# Altium schematic sheet rf_bms.SchDoc: mcHF Pro Transceiver RF board
size A3; Author: Krassi Atanassov; CompanyName: MØNKA; Engineer: For radio amateurs experimentation, non-commercial use only. Thank you!; Revision: 0.8.5; SheetTotal: 14
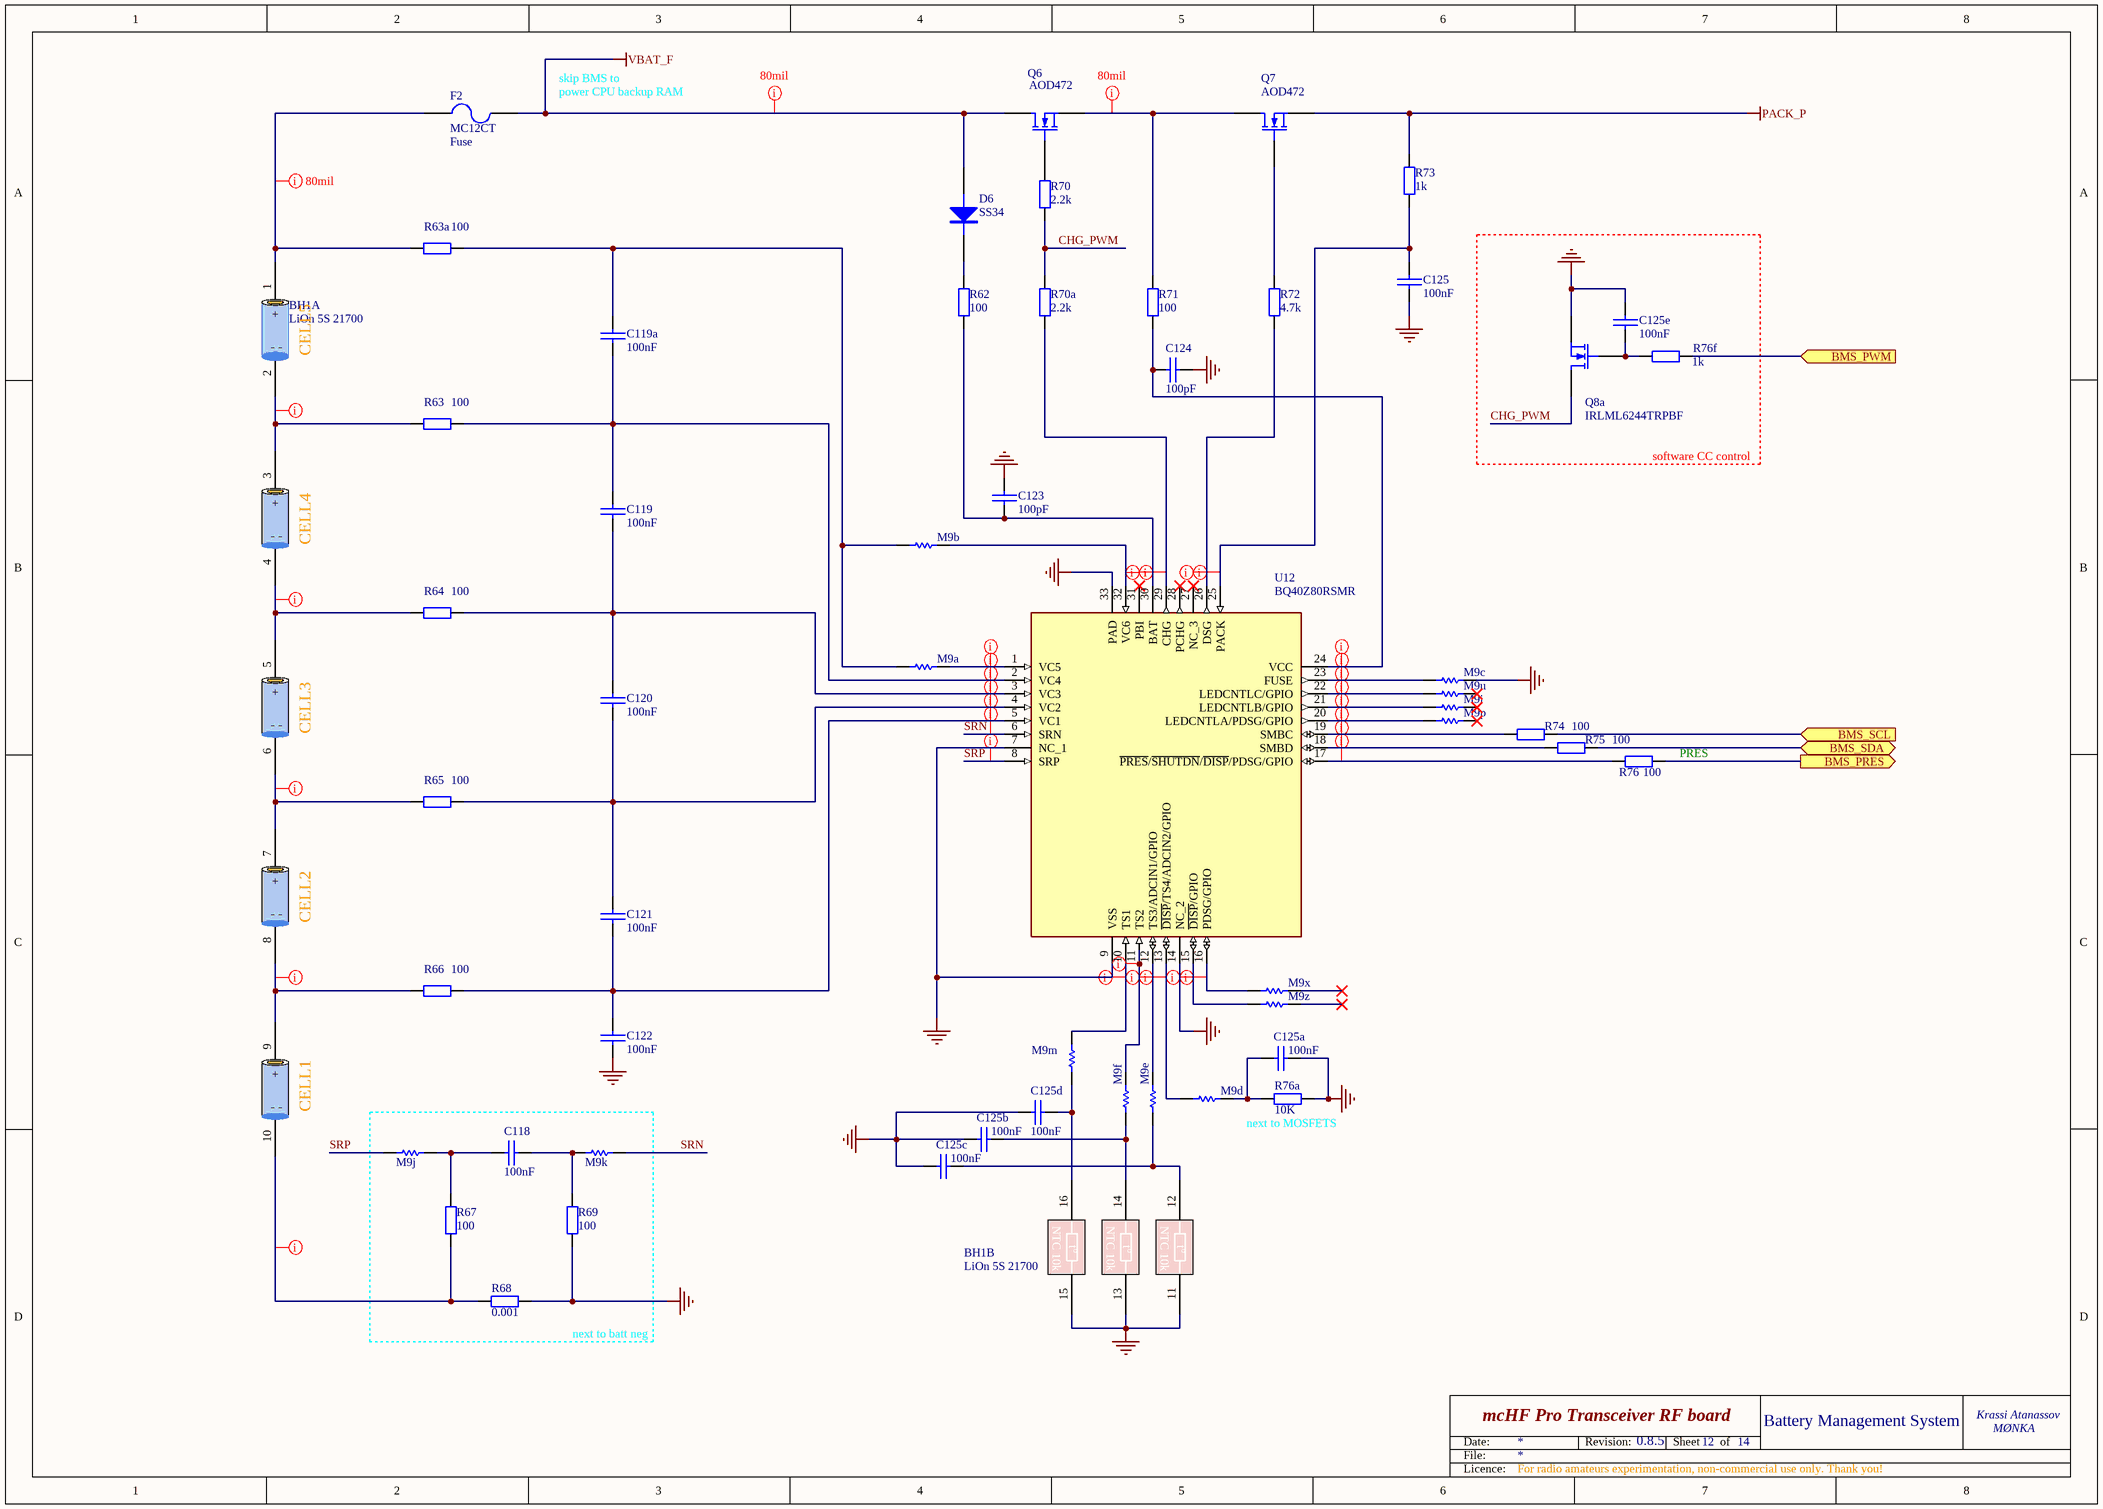
[diagram p0: rf_bms.SchDoc]

## Parts
BH1  LiOn 5S 21700  [BATT_HOLDER_5S]  (parts A,B of 2)
C118  100nF  [0805]
C119  100nF  [0805]
C119a  100nF  [0805]
C120  100nF  [0805]
C121  100nF  [0805]
C122  100nF  [0805]
C123  100pF  [0805]
C124  100pF  [0805]
C125  100nF  [0805]
C125a  100nF  [0805]
C125b  100nF  [0805]
C125c  100nF  [0805]
C125d  100nF  [0805]
C125e  100nF  [0805]
D6  SS34  [DO214]
F2  MC12CT  [1206]
M9a  0  [SB_0603_10]  (value not drawn)  (net tie, no BOM)
M9b  0  [SB_0603_10]  (value not drawn)  (net tie, no BOM)
M9c  0  [SB_0603_10]  (value not drawn)  (net tie, no BOM)
M9d  0  [SB_0603_10]  (value not drawn)  (net tie, no BOM)
M9e  0  [SB_0603_10]  (value not drawn)  (net tie, no BOM)
M9f  0  [SB_0603_10]  (value not drawn)  (net tie, no BOM)
M9i  0  [SB_0603_10]  (value not drawn)  (net tie, no BOM)
M9j  0  [SB_0603_10]  (value not drawn)  (net tie, no BOM)
M9k  0  [SB_0603_10]  (value not drawn)  (net tie, no BOM)
M9m  0  [SB_0603_10]  (value not drawn)  (net tie, no BOM)
M9p  0  [SB_0603_10]  (value not drawn)  (net tie, no BOM)
M9u  0  [SB_0603_10]  (value not drawn)  (net tie, no BOM)
M9x  0  [SB_0603_10]  (value not drawn)  (net tie, no BOM)
M9z  0  [SB_0603_10]  (value not drawn)  (net tie, no BOM)
Q6  AOD472  [TO-252]
Q7  AOD472  [TO-252]
Q8a  IRLML6244TRPBF  [SOT-23-Pro]
R62  100  [0805]
R63  100  [0805]
R63a  100  [0805]
R64  100  [0805]
R65  100  [0805]
R66  100  [0805]
R67  100  [0805]
R68  0.001  [2512]
R69  100  [0805]
R70  2.2k  [0805]
R70a  2.2k  [0805]
R71  100  [0805]
R72  4.7k  [0805]
R73  1k  [0805]
R74  100  [0805]
R75  100  [0805]
R76  100  [0805]
R76a  10K  [0805]
R76f  1k  [0805]
U12  BQ40Z80RSMR  [QFN40P400X400X100-33N-D]

## Blocks framed on the sheet
software CC control: C125e Q8a R76f
next to batt neg: C118 M9j M9k R67-R69

## Ports
BMS_PRES (out), BMS_PWM (in), BMS_SCL (in), BMS_SDA (bidir)

## Nets
GND: BH1.11 BH1.13 BH1.15 C122.2 C123.1 C124.1 C125.2 C125a.1 C125b.2 C125c.2 C125d.2 C125e.2 M9c.2 Q8a.2(S) R68.2 R69.2 R76a.2 U12.7(NC_1) U12.9(VSS) U12.14(NC_2) U12.33(PAD)
PACK_P: Q7.3(S) R73.2
VBAT_F: D6.1(A) F2.2 Q6.2(D)
BMS_PRES: R76.2 ; port BMS_PRES
BMS_PWM: R76f.2 ; port BMS_PWM
BMS_SCL: R74.2 ; port BMS_SCL
BMS_SDA: R75.2 ; port BMS_SDA
CHG_PWM: Q8a.3(D) R70.1 R70a.2
SRN: M9k.1 U12.6(SRN)
SRP: M9j.2 U12.8(SRP)
NetBH1_1: BH1.1(+) F2.1 R63a.2
NetBH1_2: BH1.2(|) BH1.3(+) R63.2
NetBH1_4: BH1.4(|) BH1.5(+) R64.2
NetBH1_6: BH1.6(|) BH1.7(+) R65.2
NetBH1_8: BH1.8(|) BH1.9(+) R66.2
NetBH1_10: BH1.10(|) R67.2 R68.1
NetBH1_12: BH1.12 C125c.1 M9e.2
NetBH1_14: BH1.14 C125b.1 M9f.2
NetBH1_16: BH1.16 C125d.1 M9m.1
NetC118_1: C118.1 M9k.2 R69.1
NetC118_2: C118.2 M9j.1 R67.1
NetC119_1: C119.1 C119a.2 R63.1 U12.2(VC4)
NetC119_2: C119.2 C120.1 R64.1 U12.3(VC3)
NetC119a_1: C119a.1 M9a.1 M9b.1 R63a.1
NetC120_2: C120.2 C121.1 R65.1 U12.4(VC2)
NetC121_2: C121.2 C122.1 R66.1 U12.5(VC1)
NetC123_2: C123.2 R62.1 U12.30(BAT)
NetC124_2: C124.2 R71.2 U12.24(VCC)
NetC125_1: C125.1 R73.1 U12.25(PACK)
NetC125a_2: C125a.2 M9d.2 R76a.1
NetC125e_1: C125e.1 Q8a.1(G) R76f.1
NetD6_2: D6.2(K) R62.2
NetM9a_2: M9a.2 U12.1(VC5)
NetM9b_2: M9b.2 U12.32(VC6)
NetM9c_1: M9c.1 U12.23(FUSE)
NetM9d_1: M9d.1 U12.13(~{DISP}/TS4/ADCIN2/GPIO)
NetM9e_1: M9e.1 U12.12(TS3/ADCIN1/GPIO)
NetM9f_1: M9f.1 U12.11(TS2)
NetM9i_1: M9i.1 U12.21(LEDCNTLB/GPIO)
NetM9m_2: M9m.2 U12.10(TS1)
NetM9p_1: M9p.1 U12.20(LEDCNTLA/PDSG/GPIO)
NetM9u_1: M9u.1 U12.22(LEDCNTLC/GPIO)
NetM9x_1: M9x.1 U12.16(PDSG/GPIO)
NetM9z_1: M9z.1 U12.15(~{DISP}/GPIO)
NetQ6_1: Q6.1(G) R70.2
NetQ6_3: Q6.3(S) Q7.2(D) R71.1
NetQ7_1: Q7.1(G) R72.2
NetR70a_1: R70a.1 U12.29(CHG)
NetR72_1: R72.1 U12.26(DSG)
NetR74_1: R74.1 U12.19(SMBC)
NetR75_1: R75.1 U12.18(SMBD)
NetR76_1: R76.1 U12.17(~{PRES}/~{SHUTDN}/~{DISP}/PDSG/GPIO)

Not connected (* = marked no-connect by the designer): M9i 2*; M9p 2*; M9u 2*; M9x 2*; M9z 2*; U12 27(NC_3)* 28(PCHG)* 31(PBI)*

## Layout directives
rule Width Constraint [Pref Width = 80mil    Min Width = 80mil    Max Width = 80mil]: NetBH1_1, NetBH1_2, NetBH1_4, NetBH1_6, NetBH1_8, NetBH1_10, NetQ6_3, VBAT_F
rule Width Constraint [Pref Width = 8mil    Min Width = 8mil    Max Width = 8mil]: NetC119_1, NetC119_2, NetC120_2, NetC121_2, NetC123_2, NetC124_2, NetC125_1, NetM9a_2, NetM9b_2, NetM9c_1, NetM9d_1, NetM9e_1, NetM9f_1, NetM9i_1, NetM9p_1, NetM9u_1, NetM9x_1, NetM9z_1, NetR70a_1, NetR72_1, NetR74_1, NetR75_1, NetR76_1
rule Width Constraint [Pref Width = 6mil    Min Width = 6mil    Max Width = 6mil]: NetM9m_2, SRN, SRP

## Notes on the sheet
- skip BMS to
- power CPU backup RAM
- (near BH1) CELL5
- (near BH1) CELL4
- (near BH1) CELL3
- (near R76) PRES
- (near BH1) CELL2
- (near BH1) CELL1
- next to MOSFETS
- 12
- Battery Management System
- Date:
- File:
- Revision:
- Sheet
- of
- Licence:
- (in symbol BATT_HOLDER_5S_21700, part B) NTC 10k; t°

## Library data of the parts
BH1 = BATT_HOLDER_5S_21700: LiOn 21700 5S Holder
C118 C119 C119a C120-C125 = CAP: Capacitor; Voltage: 100V
C125a C125b C125c C125d C125e = CAP: Capacitor; Voltage: 100V; QT Order: QCC-00154; Price: 0.068
D6 = PMEG6010CEH: DIODE, SCHOTTKY, 1A, 60V, SOD-123F; QT Order: QCD-00034; Price: 0.085
F2 = Fuse: QT Order: QCI-00216; Price: 0.134; Function: Fuse
M9a M9b M9c M9d M9e M9f M9i M9j M9k M9m M9p M9u M9x M9z = Link: Value: 1K; Published: 8-Jun-2000; Revision: July-2002: Re-released for DXP Platform.; Publisher: Altium Limited
Q6 Q7 = AOD472: N-Channel Enhancement Mode Field Effect Transistor, TO-252; Order: FN 108-1300; Price: 0.161
Q8a = MOSFET-N: N-Channel MOSFET; QT Order: QCT-00022; QT Price: 0.28; Price: 0.231
R62 R63 R63a R64-R66 = RES: Resistor; QT Order: QCR-00309; Price: 0.007
R67 R69 R70 R70a R71-R76 R76f = RES: Resistor
  R67 R69 R71 R74-R76 R76f: Price: 0.046
R68 = RES: Resistor; Order: 652-CR2512AF/1R00ELF; QT Order: QCR-00268; Notes: Tolerance better than 1%; Price: 0.009
R76a = RES: Resistor; QT Order: QCR-00579; Price: 0.061
U12 = BQ40Z80RSMR: Hardware; Manufacturer_Name: Texas Instruments; Datasheet Link: https://www.arrow.com/en/products/bq40z80rsmr/texas-instruments; Height: 1mm; Manufacturer_Part_Number: BQ40Z80RSMR; Mouser Part Number: 595-BQ40Z80RSMR; Mouser Price/Stock: https://www.mouser.co.uk/ProductDetail/Texas-Instruments/BQ40Z80RSMR?qs=%252BEew9%252B0nqrAXLQXqHAvhdw%3D%3D; Arrow Part Number: BQ40Z80RSMR; Arrow Price/Stock: https://www.arrow.com/en/products/bq40z80rsmr/texas-instruments